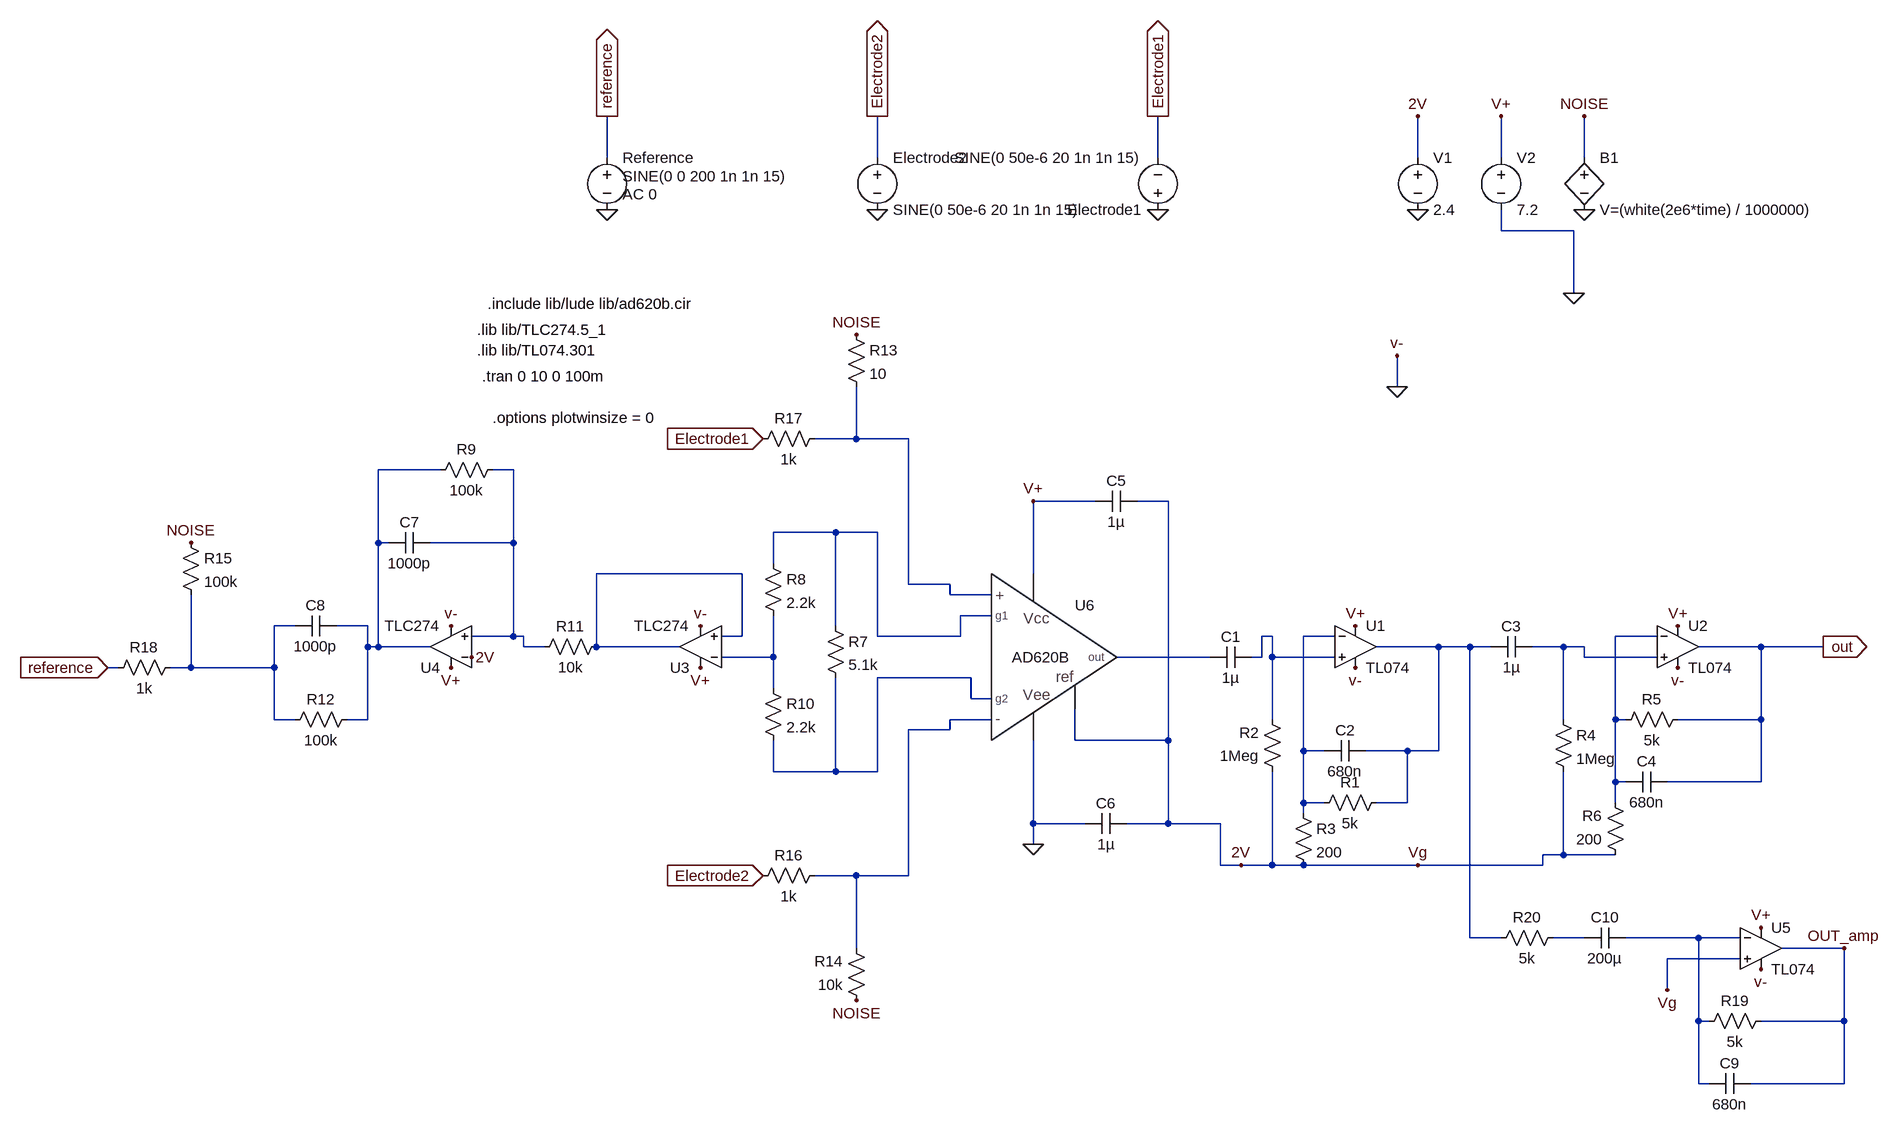
[diagram p0: schematic EEGTestCircuit1WithNoise.asc]
EEGTestCircuit1WithNoise.asc, the LTspice schematic file:
Version 4
SHEET 1 2092 1200
WIRE 112 -272 112 -336
WIRE 528 -272 528 -336
WIRE 960 -272 960 -336
WIRE 1360 -272 1360 -336
WIRE 1488 -272 1488 -336
WIRE 1616 -272 1616 -336
WIRE 1488 -160 1488 -192
WIRE 1600 -160 1488 -160
WIRE 1600 -64 1600 -160
WIRE 1328 80 1328 32
WIRE 496 160 496 80
WIRE 496 160 432 160
WIRE 576 160 496 160
WIRE -144 208 -240 208
WIRE -32 208 -64 208
WIRE 864 256 768 256
WIRE 976 256 928 256
WIRE 464 304 368 304
WIRE 528 304 464 304
WIRE -240 320 -240 208
WIRE -224 320 -240 320
WIRE -32 320 -32 208
WIRE -32 320 -160 320
WIRE 368 352 368 304
WIRE 320 368 96 368
WIRE 768 368 768 256
WIRE 576 384 576 160
WIRE 640 384 576 384
WIRE 640 400 640 384
WIRE 704 400 640 400
WIRE 704 432 656 432
WIRE -368 448 -400 448
WIRE -256 448 -304 448
WIRE 464 448 464 304
WIRE -32 464 -32 320
WIRE -32 464 -96 464
WIRE -16 464 -32 464
WIRE 320 464 320 368
WIRE 320 464 288 464
WIRE 528 464 528 304
WIRE 656 464 656 432
WIRE 656 464 528 464
WIRE 1136 464 1120 464
WIRE 1232 464 1184 464
WIRE 1728 464 1664 464
WIRE -256 480 -256 448
WIRE -240 480 -240 320
WIRE -240 480 -256 480
WIRE -160 480 -240 480
WIRE -16 480 -16 464
WIRE 16 480 -16 480
WIRE 96 480 96 368
WIRE 224 480 96 480
WIRE 1392 480 1296 480
WIRE 1440 480 1392 480
WIRE 1472 480 1440 480
WIRE 1584 480 1536 480
WIRE 1616 480 1584 480
WIRE 1888 480 1792 480
WIRE 1984 480 1888 480
WIRE 368 496 368 432
WIRE 368 496 288 496
WIRE 1040 496 896 496
WIRE 1120 496 1120 464
WIRE 1120 496 1104 496
WIRE 1136 496 1136 464
WIRE 1232 496 1136 496
WIRE 1616 496 1616 480
WIRE 1728 496 1616 496
WIRE -640 512 -656 512
WIRE -528 512 -528 400
WIRE -528 512 -560 512
WIRE -400 512 -400 448
WIRE -400 512 -528 512
WIRE 672 528 528 528
WIRE 368 544 368 496
WIRE 672 560 672 528
WIRE 704 560 672 560
WIRE -400 592 -400 512
WIRE -368 592 -400 592
WIRE -256 592 -256 480
WIRE -256 592 -288 592
WIRE 704 592 640 592
WIRE 1136 592 1136 496
WIRE 1584 592 1584 480
WIRE 1664 592 1664 464
WIRE 1680 592 1664 592
WIRE 1888 592 1888 480
WIRE 1888 592 1760 592
WIRE 640 608 640 592
WIRE 640 608 576 608
WIRE 832 624 832 576
WIRE 976 624 976 256
WIRE 976 624 832 624
WIRE 1184 640 1184 464
WIRE 1216 640 1184 640
WIRE 1344 640 1280 640
WIRE 1392 640 1392 480
WIRE 1392 640 1344 640
WIRE 368 672 368 624
WIRE 464 672 464 528
WIRE 464 672 368 672
WIRE 528 672 528 528
WIRE 528 672 464 672
WIRE 1664 688 1664 592
WIRE 1680 688 1664 688
WIRE 1888 688 1888 592
WIRE 1888 688 1744 688
WIRE 1184 720 1184 640
WIRE 1216 720 1184 720
WIRE 1344 720 1344 640
WIRE 1344 720 1296 720
WIRE 1664 720 1664 688
WIRE 1184 736 1184 720
WIRE 768 752 768 624
WIRE 848 752 768 752
WIRE 976 752 976 624
WIRE 976 752 912 752
WIRE 1056 752 976 752
WIRE 768 784 768 752
WIRE 1584 800 1584 672
WIRE 1584 800 1552 800
WIRE 1664 800 1584 800
WIRE 1056 816 1056 752
WIRE 1088 816 1056 816
WIRE 1136 816 1136 672
WIRE 1136 816 1088 816
WIRE 1184 816 1136 816
WIRE 1360 816 1184 816
WIRE 1552 816 1552 800
WIRE 1552 816 1360 816
WIRE 496 832 432 832
WIRE 576 832 576 608
WIRE 576 832 496 832
WIRE 1440 928 1440 480
WIRE 1488 928 1440 928
WIRE 1616 928 1568 928
WIRE 1792 928 1680 928
WIRE 1856 928 1792 928
WIRE 496 944 496 832
WIRE 2016 944 1920 944
WIRE 1856 960 1744 960
WIRE 1744 1008 1744 960
WIRE 1792 1056 1792 928
WIRE 1808 1056 1792 1056
WIRE 2016 1056 2016 944
WIRE 2016 1056 1888 1056
WIRE 1792 1152 1792 1056
WIRE 1808 1152 1792 1152
WIRE 2016 1152 2016 1056
WIRE 2016 1152 1872 1152
FLAG 1360 -192 0
FLAG 1600 -64 0
FLAG 1360 -336 2V
FLAG 1488 -336 V+
FLAG -656 512 reference
IOPIN -656 512 In
FLAG -128 512 V+
FLAG 256 512 V+
FLAG 1264 448 V+
FLAG 1760 448 V+
FLAG 768 256 V+
FLAG 1088 816 2V
FLAG 1984 480 out
IOPIN 1984 480 Out
FLAG 352 160 Electrode1
IOPIN 352 160 In
FLAG 352 832 Electrode2
IOPIN 352 832 In
FLAG 960 -192 0
FLAG 528 -192 0
FLAG 960 -336 Electrode1
IOPIN 960 -336 Out
FLAG 528 -336 Electrode2
IOPIN 528 -336 Out
FLAG 112 -192 0
FLAG 112 -336 reference
IOPIN 112 -336 Out
FLAG 768 784 0
FLAG 1616 -192 0
FLAG 1616 -336 NOISE
FLAG 496 0 NOISE
FLAG 496 1024 NOISE
FLAG -528 320 NOISE
FLAG -96 496 2V
FLAG 1760 512 v-
FLAG 1264 512 v-
FLAG 256 448 v-
FLAG -128 448 v-
FLAG 1328 80 0
FLAG 1328 32 v-
FLAG 1888 912 V+
FLAG 1888 976 v-
FLAG 2016 944 OUT_amp
FLAG 1744 1008 Vg
FLAG 1360 816 Vg
SYMBOL voltage 1360 -288 R0
WINDOW 123 0 0 Left 0
WINDOW 39 0 0 Left 0
SYMATTR InstName V1
SYMATTR Value 2.4
SYMBOL voltage 1488 -288 R0
WINDOW 123 0 0 Left 0
WINDOW 39 0 0 Left 0
SYMATTR InstName V2
SYMATTR Value 7.2
SYMBOL OpAmps\\opamp2 1760 416 R0
SYMATTR InstName U2
SYMATTR Value TL074
SYMBOL OpAmps\\opamp2 1264 416 R0
SYMATTR InstName U1
SYMATTR Value TL074
SYMBOL OpAmps\\opamp2 256 544 R180
SYMATTR InstName U3
SYMATTR Value TLC274
SYMBOL OpAmps\\opamp2 -128 544 R180
SYMATTR InstName U4
SYMATTR Value TLC274
SYMBOL cap 1104 480 R90
WINDOW 0 0 32 VBottom 2
WINDOW 3 32 32 VTop 2
SYMATTR InstName C1
SYMATTR Value 1µ
SYMBOL res 1312 704 R90
WINDOW 0 0 56 VBottom 2
WINDOW 3 32 56 VTop 2
SYMATTR InstName R1
SYMATTR Value 5k
SYMBOL res 1152 688 R180
WINDOW 0 36 76 Left 2
WINDOW 3 36 40 Left 2
SYMATTR InstName R2
SYMATTR Value 1Meg
SYMBOL cap 1280 624 R90
WINDOW 0 0 32 VBottom 2
WINDOW 3 32 32 VTop 2
SYMATTR InstName C2
SYMATTR Value 680n
SYMBOL res 1168 720 R0
SYMATTR InstName R3
SYMATTR Value 200
SYMBOL cap 1536 464 R90
WINDOW 0 0 32 VBottom 2
WINDOW 3 32 32 VTop 2
SYMATTR InstName C3
SYMATTR Value 1µ
SYMBOL res 1568 576 R0
SYMATTR InstName R4
SYMATTR Value 1Meg
SYMBOL res 1776 576 R90
WINDOW 0 0 56 VBottom 2
WINDOW 3 32 56 VTop 2
SYMATTR InstName R5
SYMATTR Value 5k
SYMBOL res 1680 816 R180
WINDOW 0 36 76 Left 2
WINDOW 3 36 40 Left 2
SYMATTR InstName R6
SYMATTR Value 200
SYMBOL cap 1744 672 R90
WINDOW 0 0 32 VBottom 2
WINDOW 3 32 32 VTop 2
SYMATTR InstName C4
SYMATTR Value 680n
SYMBOL cap 928 240 R90
WINDOW 0 0 32 VBottom 2
WINDOW 3 32 32 VTop 2
SYMATTR InstName C5
SYMATTR Value 1µ
SYMBOL cap 912 736 R90
WINDOW 0 0 32 VBottom 2
WINDOW 3 32 32 VTop 2
SYMATTR InstName C6
SYMATTR Value 1µ
SYMBOL res 448 432 R0
SYMATTR InstName R7
SYMATTR Value 5.1k
SYMBOL res 352 336 R0
SYMATTR InstName R8
SYMATTR Value 2.2k
SYMBOL res 352 528 R0
SYMATTR InstName R10
SYMATTR Value 2.2k
SYMBOL res 112 464 R90
WINDOW 0 0 56 VBottom 2
WINDOW 3 32 56 VTop 2
SYMATTR InstName R11
SYMATTR Value 10k
SYMBOL res -48 192 R90
WINDOW 0 0 56 VBottom 2
WINDOW 3 32 56 VTop 2
SYMATTR InstName R9
SYMATTR Value 100k
SYMBOL res -272 576 R90
WINDOW 0 0 56 VBottom 2
WINDOW 3 32 56 VTop 2
SYMATTR InstName R12
SYMATTR Value 100k
SYMBOL cap -160 304 R90
WINDOW 0 0 32 VBottom 2
WINDOW 3 32 32 VTop 2
SYMATTR InstName C7
SYMATTR Value 1000p
SYMBOL cap -304 432 R90
WINDOW 0 0 32 VBottom 2
WINDOW 3 32 32 VTop 2
SYMATTR InstName C8
SYMATTR Value 1000p
SYMBOL ad620 752 496 R0
WINDOW 3 -17 0 Left 2
SYMATTR Value AD620B
SYMATTR InstName U6
SYMBOL voltage 528 -288 R0
WINDOW 123 24 44 Left 2
WINDOW 39 0 0 Left 0
SYMATTR InstName Electrode2
SYMATTR Value SINE(0 50e-6 20 1n 1n 15)
SYMBOL voltage 960 -176 R180
WINDOW 123 24 44 Left 2
WINDOW 39 0 0 Left 0
SYMATTR InstName Electrode1
SYMATTR Value SINE(0 50e-6 20 1n 1n 15)
SYMBOL voltage 112 -288 R0
WINDOW 3 24 44 Left 2
WINDOW 123 24 72 Left 2
WINDOW 39 0 0 Left 0
SYMATTR Value SINE(0 0 200 1n 1n 15)
SYMATTR Value2 AC 0
SYMATTR InstName Reference
SYMBOL bv 1616 -288 R0
SYMATTR InstName B1
SYMATTR Value V=(white(2e6*time) / 1000000)
SYMBOL res 480 -16 R0
SYMATTR InstName R13
SYMATTR Value 10
SYMBOL res 512 1040 R180
WINDOW 0 36 76 Left 2
WINDOW 3 36 40 Left 2
SYMATTR InstName R14
SYMATTR Value 10k
SYMBOL res -544 304 R0
SYMATTR InstName R15
SYMATTR Value 100k
SYMBOL res 448 144 R90
WINDOW 0 0 56 VBottom 2
WINDOW 3 32 56 VTop 2
SYMATTR InstName R17
SYMATTR Value 1k
SYMBOL res 448 816 R90
WINDOW 0 0 56 VBottom 2
WINDOW 3 32 56 VTop 2
SYMATTR InstName R16
SYMATTR Value 1k
SYMBOL res -544 496 R90
WINDOW 0 0 56 VBottom 2
WINDOW 3 32 56 VTop 2
SYMATTR InstName R18
SYMATTR Value 1k
SYMBOL OpAmps\\opamp2 1888 880 R0
SYMATTR InstName U5
SYMATTR Value TL074
SYMBOL res 1904 1040 R90
WINDOW 0 0 56 VBottom 2
WINDOW 3 32 56 VTop 2
SYMATTR InstName R19
SYMATTR Value 5k
SYMBOL cap 1872 1136 R90
WINDOW 0 0 32 VBottom 2
WINDOW 3 32 32 VTop 2
SYMATTR InstName C9
SYMATTR Value 680n
SYMBOL res 1584 912 R90
WINDOW 0 0 56 VBottom 2
WINDOW 3 32 56 VTop 2
SYMATTR InstName R20
SYMATTR Value 5k
SYMBOL cap 1680 912 R90
WINDOW 0 0 32 VBottom 2
WINDOW 3 32 32 VTop 2
SYMATTR InstName C10
SYMATTR Value 200µ
TEXT -88 24 Left 2 !.lib lib/TL074.301
TEXT -80 64 Left 2 !.tran 0 10 0 100m
TEXT -64 128 Left 2 !.options plotwinsize = 0
TEXT -88 -8 Left 2 !.lib lib/TLC274.5_1
TEXT -72 -48 Left 2 !.include lib/lude lib/ad620b.cir

The netlist it stands for:
* EEGTestCircuit1WithNoise.asc
V1 Vg 0 2.4
V2 V+ 0 7.2
XU2 N011 N009 V+ 0 out TL074  ; pins In+ In- V+ V- OUT
XU1 N007 N008 V+ 0 N010 TL074  ; pins In+ In- V+ V- OUT
XU3 N005 N012 V+ 0 N005 TLC274  ; pins In+ In- V+ V- OUT
XU4 N003 Vg V+ 0 N002 TLC274  ; pins In+ In- V+ V- OUT
C1 N007 N013 1µ
R1 N010 N008 5k
R2 Vg N007 1Meg
C2 N010 N008 680n
R3 N008 Vg 200
C3 N011 N010 1µ
R4 N011 Vg 1Meg
R5 out N009 5k
R6 Vg N009 200
C4 out N009 680n
C5 Vg V+ 1µ
C6 Vg 0 1µ
R7 N004 N014 5.1k
R8 N004 N012 2.2k
R10 N012 N014 2.2k
R11 N005 N003 10k
R9 N003 N002 100k
R12 N002 N006 100k
C7 N003 N002 1000p
C8 N002 N006 1000p
XU6 N001 N015 V+ 0 N013 Vg N004 N014 AD620B  ; pins inp inm Vcc Vee out ref g1 g2
V§Electrode2 Electrode2 0 SINE(0 50e-6 20 1n 1n 15)
V§Electrode1 0 Electrode1 SINE(0 50e-6 20 1n 1n 15)
V§Reference reference 0 SINE(0 0 200 1n 1n 15) AC 0
B1 NOISE 0 V=(white(2e6*time) / 1000000)
R13 NOISE N001 10
R14 NOISE N015 10k
R15 NOISE N006 100k
R17 N001 Electrode1 1k
R16 N015 Electrode2 1k
R18 N006 reference 1k
XU5 Vg N017 V+ 0 OUT_amp TL074  ; pins In+ In- V+ V- OUT
R19 OUT_amp N017 5k
C9 OUT_amp N017 680n
R20 N016 N010 5k
C10 N017 N016 200µ
.lib lib/TL074.301
.tran 0 10 0 100m
.options plotwinsize = 0
.lib lib/TLC274.5_1
.include lib/lude lib/ad620b.cir
.backanno
.end